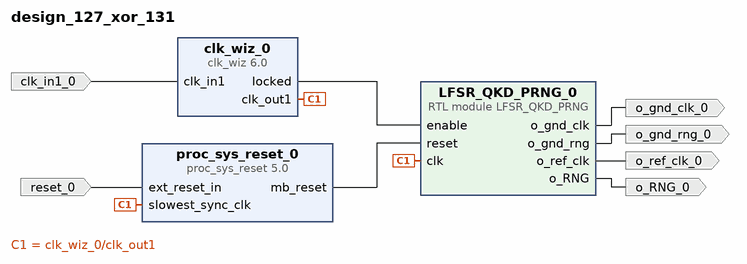
[diagram p0: block diagram of the top level]
# Vivado block design design_127_xor_131, xc7a35ticsg324-1L, Vivado 2020.2
create_bd_design design_127_xor_131

create_bd_port -dir I -type clk clk_in1_0
create_bd_port -dir I -type rst reset_0
create_bd_port -dir O o_RNG_0
create_bd_port -dir O -type clk o_ref_clk_0
create_bd_port -dir O o_gnd_rng_0
create_bd_port -dir O -type clk o_gnd_clk_0

create_bd_cell -type ip -vlnv xilinx.com:ip:clk_wiz:6.0 clk_wiz_0
set_property -dict [list \
  CONFIG.CLKOUT1_JITTER 103.364 \
  CONFIG.CLKOUT1_PHASE_ERROR 88.161 \
  CONFIG.CLKOUT1_REQUESTED_OUT_FREQ 200 \
  CONFIG.JITTER_SEL Min_O_Jitter \
  CONFIG.MMCM_BANDWIDTH HIGH \
  CONFIG.MMCM_CLKFBOUT_MULT_F 11.750 \
  CONFIG.MMCM_CLKOUT0_DIVIDE_F 5.875 \
  CONFIG.USE_RESET false \
] [get_bd_cells clk_wiz_0]
create_bd_cell -type ip -vlnv xilinx.com:ip:proc_sys_reset:5.0 proc_sys_reset_0
create_bd_cell -type module -reference LFSR_QKD_PRNG LFSR_QKD_PRNG_0

# ---- connections ----

connect_bd_net [get_bd_pins clk_wiz_0/locked] [get_bd_pins LFSR_QKD_PRNG_0/enable]
connect_bd_net [get_bd_pins clk_wiz_0/clk_out1] [get_bd_pins proc_sys_reset_0/slowest_sync_clk] [get_bd_pins LFSR_QKD_PRNG_0/clk]
connect_bd_net -net clk_in1_0_1 [get_bd_ports clk_in1_0] [get_bd_pins clk_wiz_0/clk_in1]
connect_bd_net -net reset_0_1 [get_bd_ports reset_0] [get_bd_pins proc_sys_reset_0/ext_reset_in]
connect_bd_net [get_bd_pins proc_sys_reset_0/mb_reset] [get_bd_pins LFSR_QKD_PRNG_0/reset]
connect_bd_net [get_bd_pins LFSR_QKD_PRNG_0/o_RNG] [get_bd_ports o_RNG_0]
connect_bd_net [get_bd_pins LFSR_QKD_PRNG_0/o_ref_clk] [get_bd_ports o_ref_clk_0]
connect_bd_net [get_bd_pins LFSR_QKD_PRNG_0/o_gnd_rng] [get_bd_ports o_gnd_rng_0]
connect_bd_net [get_bd_pins LFSR_QKD_PRNG_0/o_gnd_clk] [get_bd_ports o_gnd_clk_0]

validate_bd_design
save_bd_design
